# Altium schematic sheet Sheet1.SchDoc
size A3; SheetNumber: 1; SheetTotal: 1
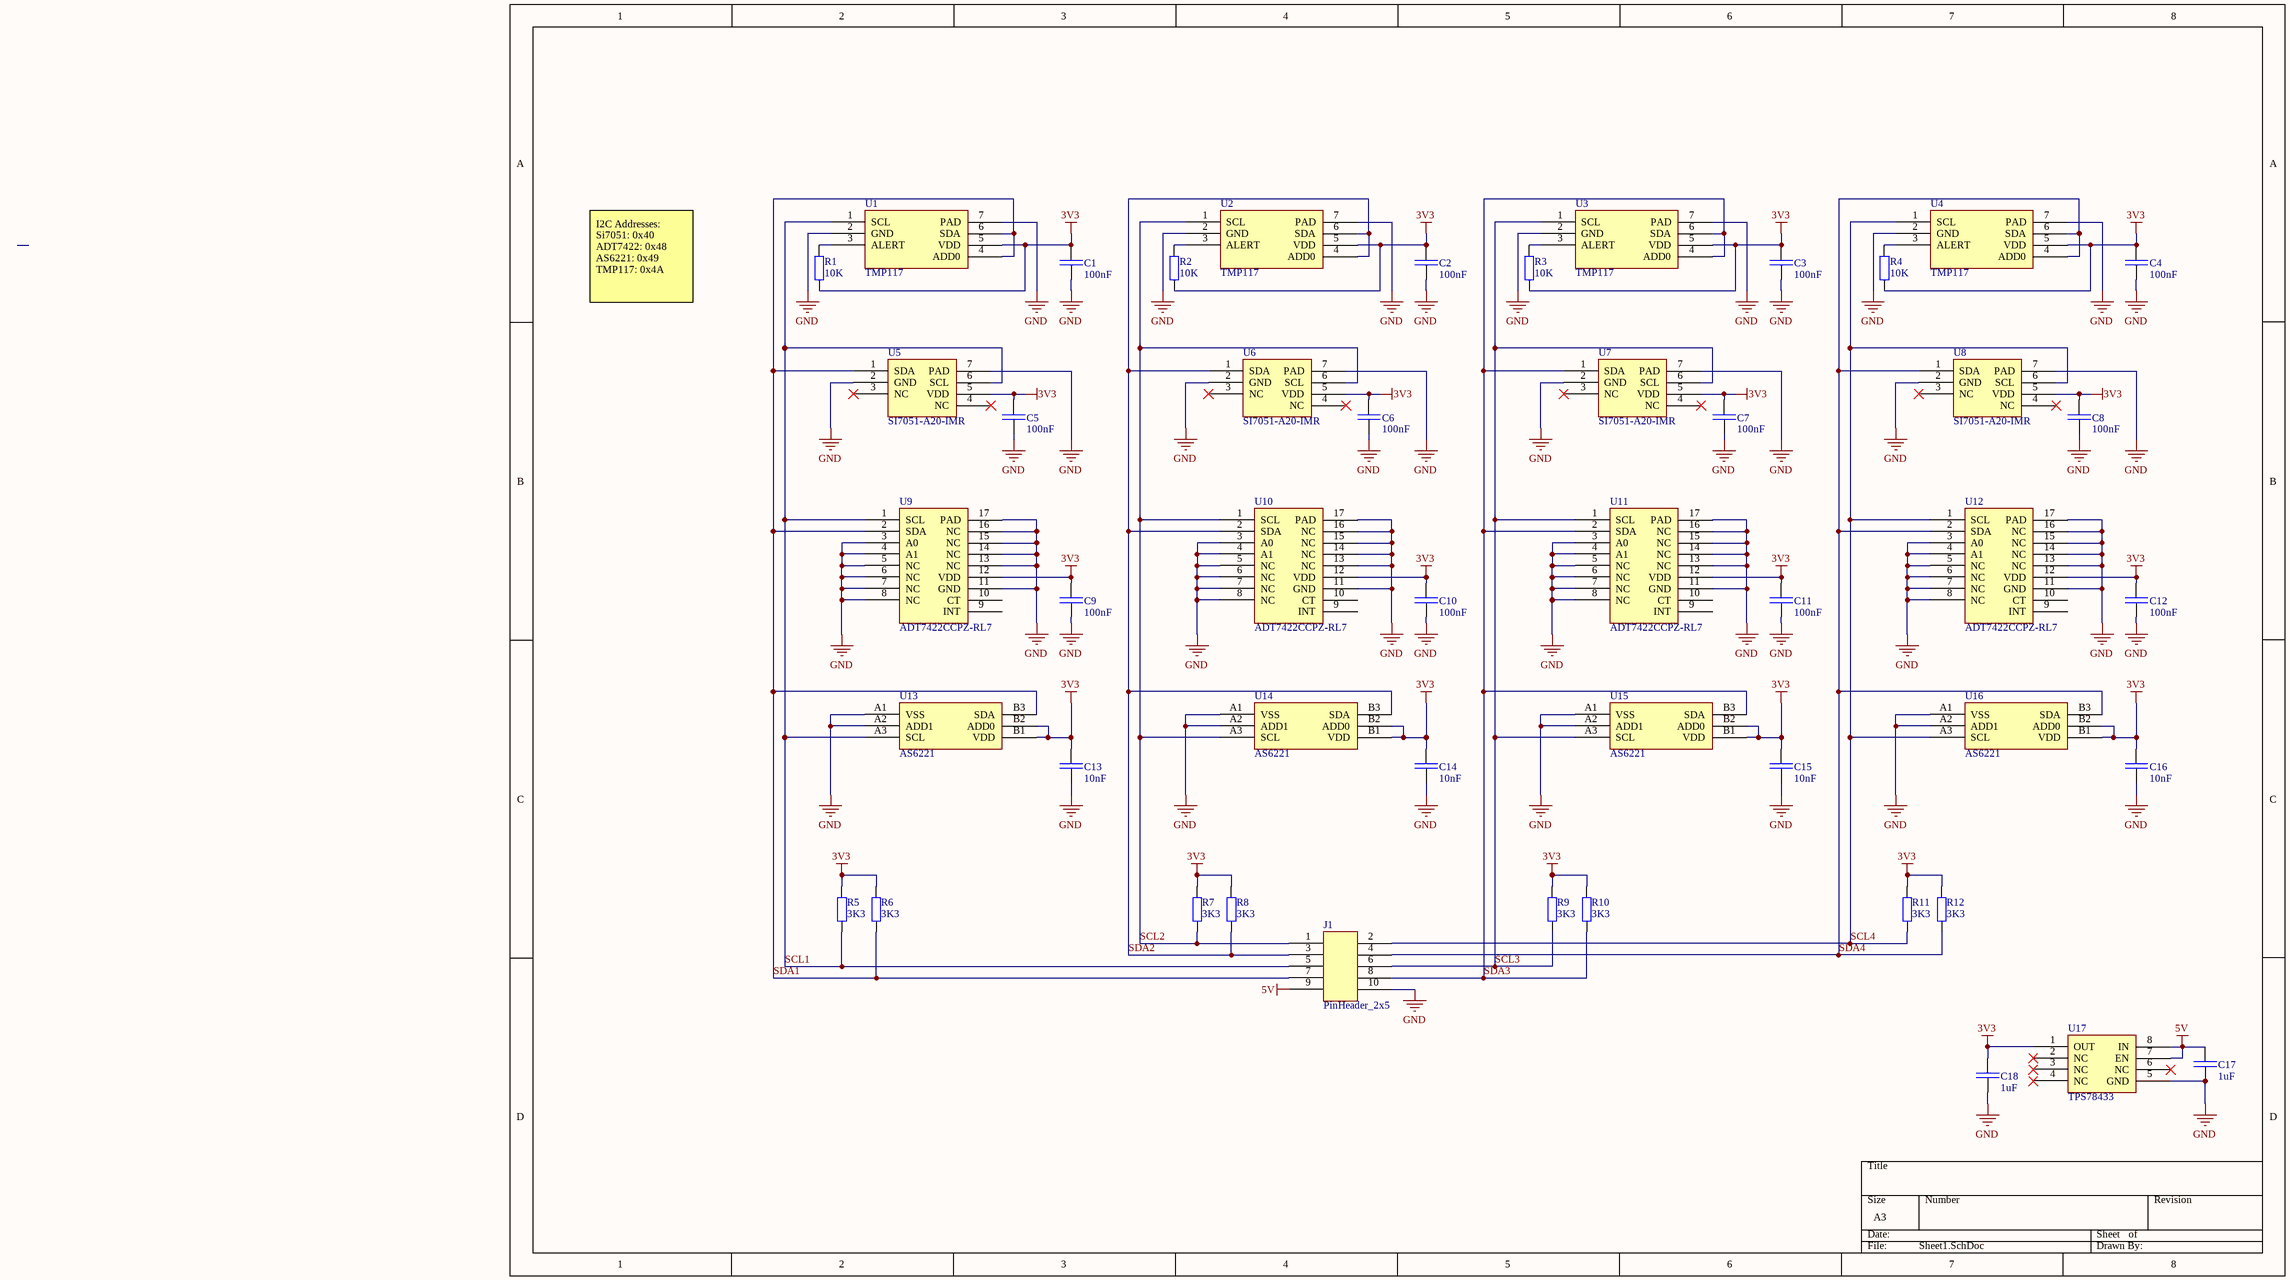
[diagram p0: Sheet1.SchDoc]

## Parts
C1  100nF  [CAP_SM0603_YAGEOCC2_N]
C2  100nF  [CAP_SM0603_YAGEOCC2_N]
C3  100nF  [CAP_SM0603_YAGEOCC2_N]
C4  100nF  [CAP_SM0603_YAGEOCC2_N]
C5  100nF  [CAP_SM0603_YAGEOCC2_N]
C6  100nF  [CAP_SM0603_YAGEOCC2_N]
C7  100nF  [CAP_SM0603_YAGEOCC2_N]
C8  100nF  [CAP_SM0603_YAGEOCC2_N]
C9  100nF  [CAP_SM0603_YAGEOCC2_N]
C10  100nF  [CAP_SM0603_YAGEOCC2_N]
C11  100nF  [CAP_SM0603_YAGEOCC2_N]
C12  100nF  [CAP_SM0603_YAGEOCC2_N]
C13  10nF  [CAP_SM0402_YAGEOCC2_N]
C14  10nF  [CAP_SM0402_YAGEOCC2_N]
C15  10nF  [CAP_SM0402_YAGEOCC2_N]
C16  10nF  [CAP_SM0402_YAGEOCC2_N]
C17  1uF  [CAP_SM0805_YAGEOCC2_N]
C18  1uF  [CAP_SM0805_YAGEOCC2_N]
J1  PinHeader_2x5  [PinHeader_2x5_2.54mm]
R1  10K  [RES_SM0603_YAGEORC_N]
R2  10K  [RES_SM0603_YAGEORC_N]
R3  10K  [RES_SM0603_YAGEORC_N]
R4  10K  [RES_SM0603_YAGEORC_N]
R5  3K3  [RES_SM0603_YAGEORC_N]
R6  3K3  [RES_SM0603_YAGEORC_N]
R7  3K3  [RES_SM0603_YAGEORC_N]
R8  3K3  [RES_SM0603_YAGEORC_N]
R9  3K3  [RES_SM0603_YAGEORC_N]
R10  3K3  [RES_SM0603_YAGEORC_N]
R11  3K3  [RES_SM0603_YAGEORC_N]
R12  3K3  [RES_SM0603_YAGEORC_N]
U1  TMP117  [TMP117(N/M)AIDRV_WSON]
U2  TMP117  [TMP117(N/M)AIDRV_WSON]
U3  TMP117  [TMP117(N/M)AIDRV_WSON]
U4  TMP117  [TMP117(N/M)AIDRV_WSON]
U5  SI7051-A20-IMR  [SI7050/1/2/3/4/5]
U6  SI7051-A20-IMR  [SI7050/1/2/3/4/5]
U7  SI7051-A20-IMR  [SI7050/1/2/3/4/5]
U8  SI7051-A20-IMR  [SI7050/1/2/3/4/5]
U9  ADT7422CCPZ-RL7  [ADT7422_QFN]
U10  ADT7422CCPZ-RL7  [ADT7422_QFN]
U11  ADT7422CCPZ-RL7  [ADT7422_QFN]
U12  ADT7422CCPZ-RL7  [ADT7422_QFN]
U13  AS6221  [AS6221_BGA]
U14  AS6221  [AS6221_BGA]
U15  AS6221  [AS6221_BGA]
U16  AS6221  [AS6221_BGA]
U17  TPS78433  [TPS784xxxQDRBRQ1_SON]

## Nets
3V3: C1.2 C2.2 C3.2 C4.2 C5.2 C6.2 C7.2 C8.2 C9.2 C10.2 C11.2 C12.2 C13.1 C14.1 C15.1 C16.1 C18.2 R1.1 R2.1 R3.1 R4.1 R5.2 R6.2 R7.2 R8.2 R9.2 R10.2 R11.2 R12.2 U1.5(VDD) U2.5(VDD) U3.5(VDD) U4.5(VDD) U5.5(VDD) U6.5(VDD) U7.5(VDD) U8.5(VDD) U9.12(VDD) U10.12(VDD) U11.12(VDD) U12.12(VDD) U13.B1(VDD) U13.B2(ADD0) U14.B1(VDD) U14.B2(ADD0) U15.B1(VDD) U15.B2(ADD0) U16.B1(VDD) U16.B2(ADD0) U17.1(OUT)
5V: C17.2 J1.9 U17.7(EN) U17.8(IN)
GND: C1.1 C2.1 C3.1 C4.1 C5.1 C6.1 C7.1 C8.1 C9.1 C10.1 C11.1 C12.1 C13.2 C14.2 C15.2 C16.2 C17.1 C18.1 J1.10 U1.2(GND) U1.7(PAD) U2.2(GND) U2.7(PAD) U3.2(GND) U3.7(PAD) U4.2(GND) U4.7(PAD) U5.2(GND) U5.7(PAD) U6.2(GND) U6.7(PAD) U7.2(GND) U7.7(PAD) U8.2(GND) U8.7(PAD) U9.3(A0) U9.4(A1) U9.5(NC) U9.6(NC) U9.7(NC) U9.8(NC) U9.11(GND) U9.13(NC) U9.14(NC) U9.15(NC) U9.16(NC) U9.17(PAD) U10.3(A0) U10.4(A1) U10.5(NC) U10.6(NC) U10.7(NC) U10.8(NC) U10.11(GND) U10.13(NC) U10.14(NC) U10.15(NC) U10.16(NC) U10.17(PAD) U11.3(A0) U11.4(A1) U11.5(NC) U11.6(NC) U11.7(NC) U11.8(NC) U11.11(GND) U11.13(NC) U11.14(NC) U11.15(NC) U11.16(NC) U11.17(PAD) U12.3(A0) U12.4(A1) U12.5(NC) U12.6(NC) U12.7(NC) U12.8(NC) U12.11(GND) U12.13(NC) U12.14(NC) U12.15(NC) U12.16(NC) U12.17(PAD) U13.A1(VSS) U13.A2(ADD1) U14.A1(VSS) U14.A2(ADD1) U15.A1(VSS) U15.A2(ADD1) U16.A1(VSS) U16.A2(ADD1) U17.5(GND)
SCL1: J1.5 R5.1 U1.1(SCL) U5.6(SCL) U9.1(SCL) U13.A3(SCL)
SCL2: J1.1 R7.1 U2.1(SCL) U6.6(SCL) U10.1(SCL) U14.A3(SCL)
SCL3: J1.6 R9.1 U3.1(SCL) U7.6(SCL) U11.1(SCL) U15.A3(SCL)
SCL4: J1.2 R11.1 U4.1(SCL) U8.6(SCL) U12.1(SCL) U16.A3(SCL)
SDA1: J1.7 R6.1 U1.4(ADD0) U1.6(SDA) U5.1(SDA) U9.2(SDA) U13.B3(SDA)
SDA2: J1.3 R8.1 U2.4(ADD0) U2.6(SDA) U6.1(SDA) U10.2(SDA) U14.B3(SDA)
SDA3: J1.8 R10.1 U3.4(ADD0) U3.6(SDA) U7.1(SDA) U11.2(SDA) U15.B3(SDA)
SDA4: J1.4 R12.1 U4.4(ADD0) U4.6(SDA) U8.1(SDA) U12.2(SDA) U16.B3(SDA)
NetR1_2: R1.2 U1.3(ALERT)
NetR2_2: R2.2 U2.3(ALERT)
NetR3_2: R3.2 U3.3(ALERT)
NetR4_2: R4.2 U4.3(ALERT)

Not connected (* = marked no-connect by the designer): U5 3(NC)* 4(NC)*; U6 3(NC)* 4(NC)*; U7 3(NC)* 4(NC)*; U8 3(NC)* 4(NC)*; U9 9(INT) 10(CT); U10 9(INT) 10(CT); U11 9(INT) 10(CT); U12 9(INT) 10(CT); U17 2(NC)* 3(NC)* 4(NC)* 6(NC)*

## Notes on the sheet
- I2C Addresses:
  Si7051: 0x40
  ADT7422: 0x48
  AS6221: 0x49
  TMP117: 0x4A

## Library data of the parts
C1-C12 = CC0603KRX7R9BB104: CAP 100nF SM0603 X7R 50V YAGEO CC2; Tolerance (%): 10; Voltage Rating (Volts): 50; Value: 100nF; Category: Capacitor; Manufacturer: Yageo; Manufacturer Part Number: CC0603KRX7R9BB104; Package: 0603; Supplier Part Number 1: 1362556; Supplier 1: Farnell; ComponentLink1URL: http://www.yageo.com; ComponentLink1Description: Manufacturer Website; Supplier 2: Mouser; Supplier Part Number 2: 603-CC603KRX7R9BB104
C13-C16 = CC0402KRX7R9BB103: CAP 10nF SM0402 X7R 50V YAGEO CC2; Manufacturer Part Number: CC0603KRX7R9BB103; Tolerance (%): 10; Voltage Rating (Volts): 50; Category: Capacitor; Manufacturer: Yageo; Package: 0603; Value: 10nF; Supplier Part Number 1: 3369167; Supplier 1: Farnell; ComponentLink1URL: http://www.yageo.com; ComponentLink1Description: Manufacturer Website; Supplier 2: Mouser; Supplier Part Number 2: 603-CC402KRX7R9BB103; Supplier 3: Digi-Key; Supplier Part Number 3: 311-1349-1-ND
C17 C18 = CC0805KKX7R8BB105: CAP 1uF SM0805 X7R 25V YAGEO CC2; Tolerance (%): 10; Voltage Rating (Volts): 25; Value: 1uF; Category: Capacitor; Manufacturer: Yageo; Manufacturer Part Number: CC0805KKX7R8BB105; Package: 0805; Supplier Part Number 1: 1458903; Supplier 1: Farnell; ComponentLink1URL: http://www.yageo.com; ComponentLink1Description: Manufacturer Website; Supplier 2: Digi-Key; Supplier Part Number 2: 311-1456-1-ND; Supplier 3: Mouser; Supplier Part Number 3: 603-CC805KKX7R8BB105
J1 = PinHeader_2x5_2.54mm: PinHeader_2x5 2.54mm Pitch
R1-R4 = RC0603FR-0710KL: RES 10K SM0603 YAGEO RC_L; Power (Watts): 0.1; Resistance (Ohms): 10000; Tolerance (%): 1; Value: 10K; Category: Resistor; Manufacturer: Yageo; Manufacturer Part Number: RC0603FR-0710KL; Package: 0603; Supplier Part Number 1: 9238603; Supplier 1: Farnell; ComponentLink1URL: http://www.yageo.com; ComponentLink1Description: Manufacturer Website; Supplier 2: Digi-Key; Supplier Part Number 2: 311-10.0KHRCT-ND
R5-R12 = RC0603FR-073K3L: RES 3.3K SM0603 YAGEO RC_L; Manufacturer Part Number: RC0603FR-0710KL; Power (Watts): 0.1; Resistance (Ohms): 10000; Tolerance (%): 1; Category: Resistor; Manufacturer: Yageo; Package: 0603; Value: 3K3; ComponentLink1URL: http://www.yageo.com; ComponentLink1Description: Manufacturer Website; Supplier 1: Future Electronics; Supplier Part Number 1: 6497630; Supplier 2: Rs; Supplier Part Number 2: 1995564; Supplier 3: Rs; Supplier Part Number 3: 1995564P; Supplier 4: Rs; Supplier Part Number 4: 1995563; Supplier 5: Avnet; Supplier Part Number 5: RC0603FR-073K3L; Supplier 6: Arrow Electronics; Supplier Part Number 6: RC0603FR-073K3L; Supplier 7: Farnell; Supplier Part Number 7: 9238549; Supplier 8: Farnell; Supplier Part Number 8: 9238549RL; Supplier 9: Mouser; Supplier Part Number 9: 603-RC0603FR-073K3L; Supplier 10: Digikey; Supplier Part Number 10: 311-3.30KHRCT-ND; Supplier 11: Digikey; Supplier Part Number 11: 311-3.30KHRDKR-ND; Supplier 12: Digikey; Supplier Part Number 12: 311-3.30KHRTR-ND
U1-U4 = TMP117NAIDRVR: TMP117 High-Accuracy, Low-Power, Digital Temperature Sensor, -55°C bis 150°C, 16b 6-WSON (2x2); Supplier 1: Mouser; Supplier Part Number 1: 595-TMP117NAIDRVR; Supplier 2: Digi-Key; Supplier Part Number 2: 296-51836-6-ND
U5-U8 = SI7051-A20-IMR: Si7051-A20 Temperature Sensor ±0.1°C maximum accuracy, Digital I2C, -40°C ~ 125°C 14b 6-DFN (3x3); Supplier 1: Farnell; Supplier Part Number 1: 3265013RL; Supplier 2: Mouser; Supplier Part Number 2: 634-SI7051-A20-IMR; Supplier 3: Digi-Key; Supplier Part Number 3: 336-4764-1-ND
U9-U12 = ADT7422CCPZ-RL7: ADT7422 Temperature Sensor, ±0.1°C Accuracy, 16b, Digital I2C / -40°C bis 125°C 16-LFCSP-WQ (4x4); Supplier 1: Mouser; Supplier Part Number 1: 584-ADT7422CCPZ-RL7; Supplier 2: Digi-Key; Supplier Part Number 2: 505-ADT7422CCPZ-RL7CT-ND
U13-U16 = AS6221-AWLT-S: AS6221 Temperature Sensor Digital -40°C ~ 125°C 16b 6-WLCSP (1.5x1.03); Supplier 1: Mouser; Supplier Part Number 1: 985-AS6221-AWLT-S; Supplier 2: Digi-Key; Supplier Part Number 2: 4991-AS6221-AWLT-SCT-ND
U17 = TPS78433QWDRBRQ1: TPS78433-Q1 3.3V, 300-mA, High-PSRR Low-Dropout Voltage Regulator With High Accuracy and Enable,  8-SON (3x3); Supplier 1: Mouser; Supplier Part Number 1: 595-TPS78433QWDRBRQ1; Supplier 2: Digi-Key; Supplier Part Number 2: 296-TPS78433QWDRBRQ1CT-ND